# EAGLE design HSHV4-student version (EAGLE 7.2.0)
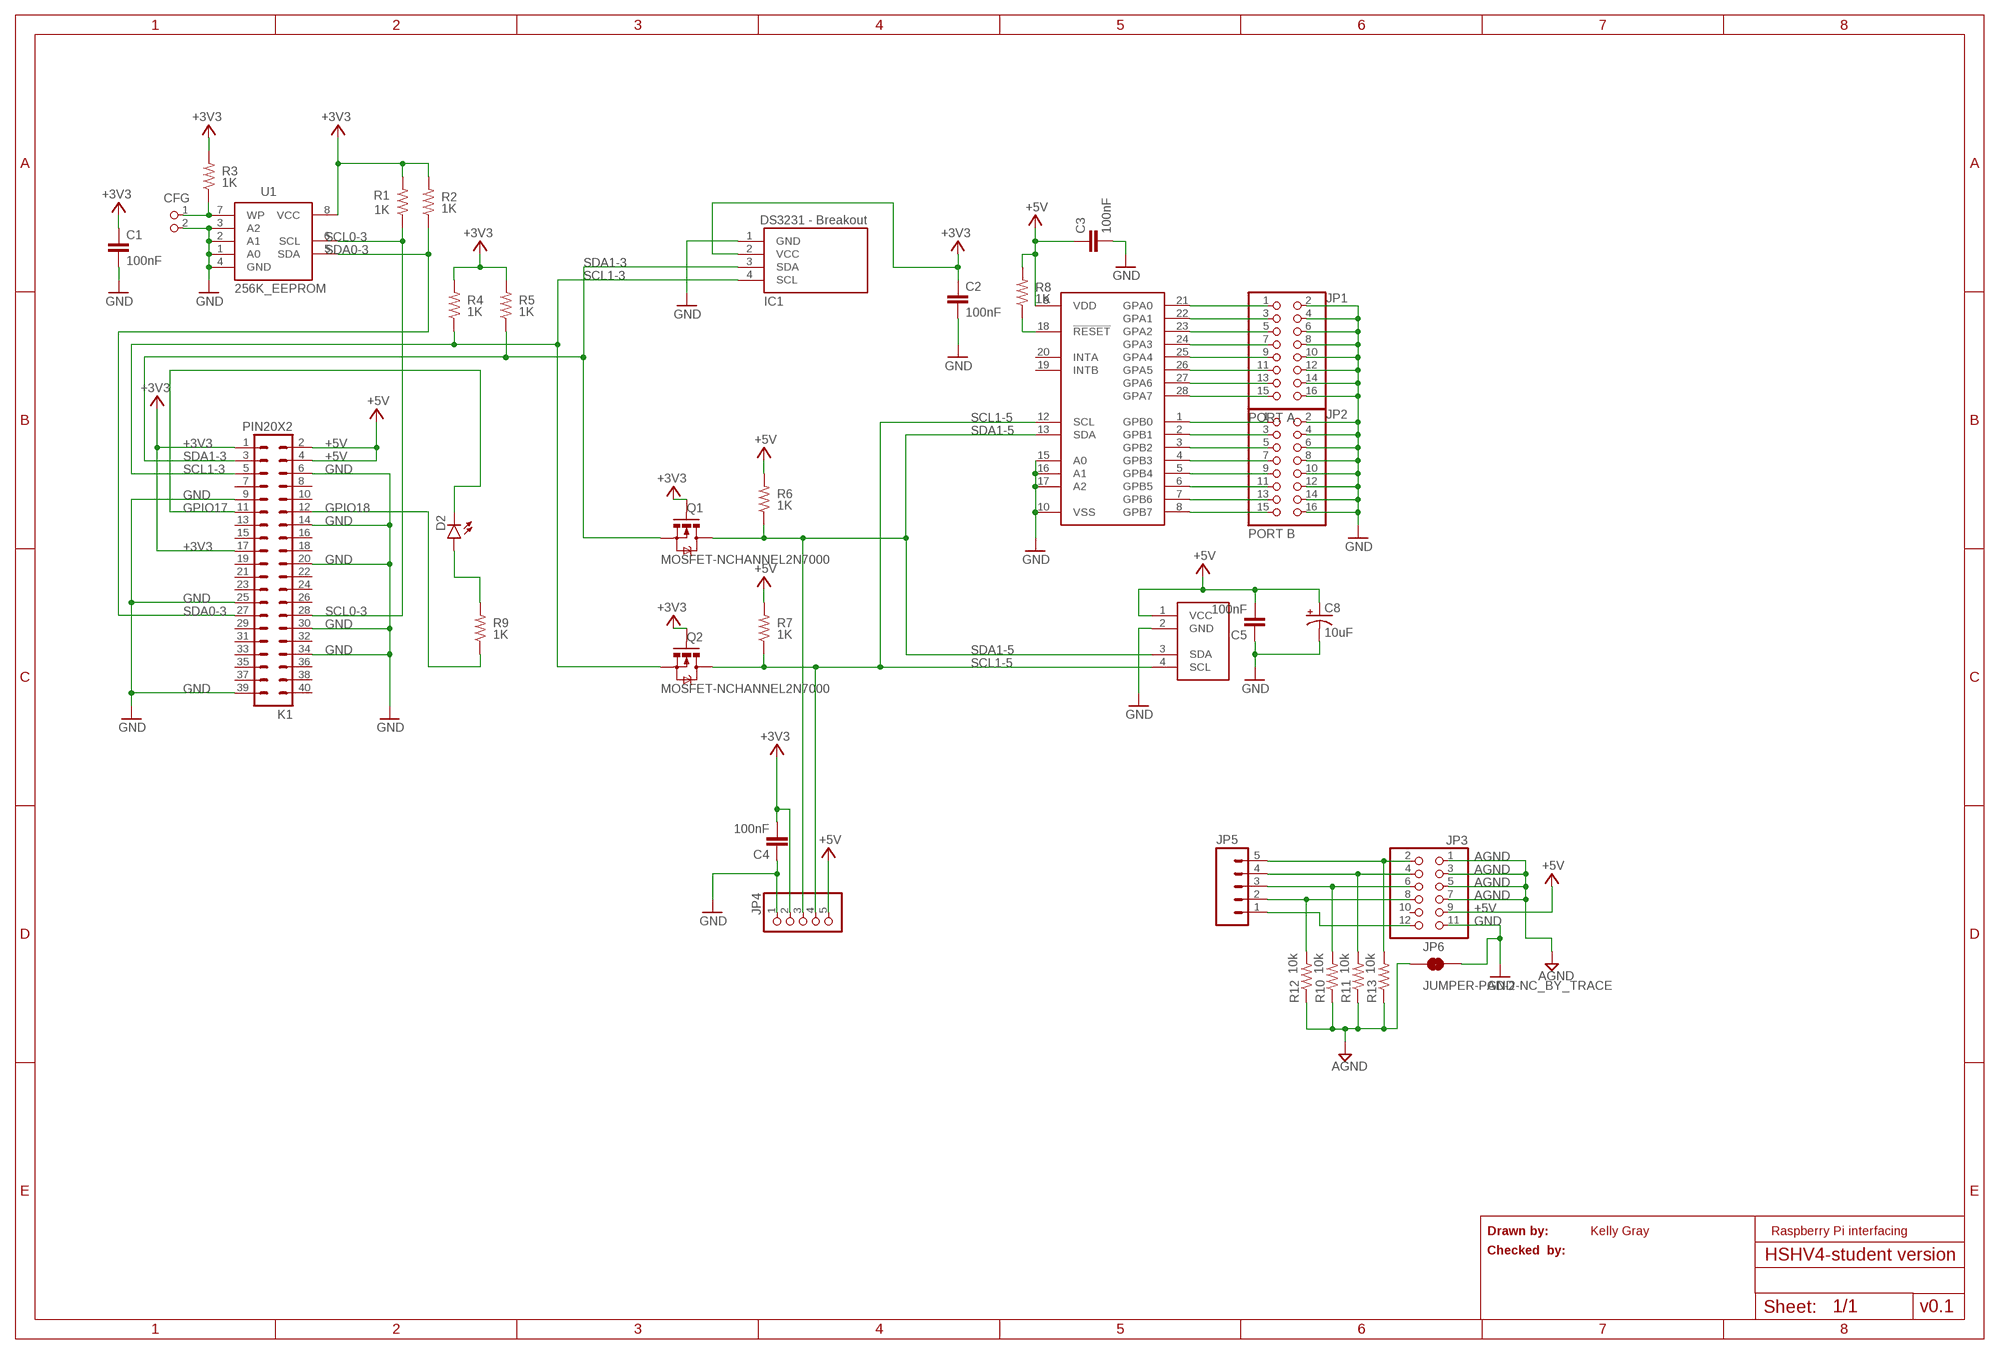
[diagram p0: schematic, sheet 1]

## Parts
C1  100nF  0.1UF-50V-20%(PTH)KIT-EZ  [CAP-PTH-SMALL-KIT]
C2  100nF  0.1UF-50V-20%(PTH)KIT-EZ  [CAP-PTH-SMALL-KIT]
C3  100nF  0.1UF-50V-20%(PTH)KIT-EZ  [CAP-PTH-SMALL-KIT]
C4  100nF  0.1UF-50V-20%(PTH)KIT-EZ  [CAP-PTH-SMALL-KIT]
C5  100nF  0.1UF-50V-20%(PTH)KIT-EZ  [CAP-PTH-SMALL-KIT]
C8  10uF  10UF-25V-20%(PTH)  [CPOL-RADIAL-10UF-25V]
CFG  PIN2_100  [PIN_W_2]
D2  LED-3MM-NO_SILK  [LED3MM-NS]
IC1  DS3231  [8PTH]
IC4  IO_EXPANDER  [DIL28-3]
JP1  PORT A  PINHD-2X8  [2X08]
JP2  PORT B  PINHD-2X8  [2X08]
JP3  PINHD-2X6  [2X06]
JP4  PINHD-1X5  [1X05]
JP5  M05PTH  [1X05]
JP6  JUMPER-PAD-2-NC_BY_TRACE  [PAD-JUMPER-2-NC_BY_TRACE_YES_SILK]
K1  PIN20X2  [PIN_20X2]
Q1  MOSFET-NCHANNEL2N7000  [TO-92]
Q2  MOSFET-NCHANNEL2N7000  [TO-92]
R1  1K  1KOHM-1/4W-1%(PTH)  [AXIAL-0.3]
R2  1K  1KOHM-1/4W-1%(PTH)  [AXIAL-0.3]
R3  1K  1KOHM-1/4W-1%(PTH)  [AXIAL-0.3]
R4  1K  1KOHM-1/4W-1%(PTH)  [AXIAL-0.3]
R5  1K  1KOHM-1/4W-1%(PTH)  [AXIAL-0.3]
R6  1K  1KOHM-1/4W-1%(PTH)  [AXIAL-0.3]
R7  1K  1KOHM-1/4W-1%(PTH)  [AXIAL-0.3]
R8  1K  1KOHM-1/4W-1%(PTH)  [AXIAL-0.3]
R9  1K  1KOHM-1/4W-1%(PTH)  [AXIAL-0.3]
R10  10k  10KOHM-1/4W-1%(PTH)HORIZ  [AXIAL-0.3]
R11  10k  10KOHM-1/4W-1%(PTH)HORIZ  [AXIAL-0.3]
R12  10k  10KOHM-1/4W-1%(PTH)HORIZ  [AXIAL-0.3]
R13  10k  10KOHM-1/4W-1%(PTH)HORIZ  [AXIAL-0.3]
U1  256K_EEPROM  [DIL08]
U$1  PCF8591  [1X04]

## Nets
+3V3: C1.1 C2.1 C4.2 IC1.2(VCC) JP4.2 K1.1 K1.17 Q1.2(G) Q2.2(G) R1.P$2 R2.P$2 R3.P$2 R4.P$2 R5.P$2 U1.8(VCC)
+5V: C3.1 C5.2 C8.1(+) IC4.9(VDD) JP3.9 JP4.5 K1.2 K1.4 R6.P$2 R7.P$2 R8.P$2 U$1.1(VCC)
AGND: JP3.1 JP3.3 JP3.5 JP3.7 JP6.1 R10.P$1 R11.P$1 R12.P$1 R13.P$1
AIN0: JP3.8 JP5.2 R12.P$2
AIN1: JP3.6 JP5.3 R10.P$2
AIN2: JP3.4 JP5.4 R11.P$2
AIN3: JP3.2 JP5.5 R13.P$2
GND: C1.2 C2.2 C3.2 C4.1 C5.1 C8.2(-) CFG.2 IC1.1(GND) IC4.10(VSS) IC4.15(A0) IC4.16(A1) IC4.17(A2) JP1.2 JP1.4 JP1.6 JP1.8 JP1.10 JP1.12 JP1.14 JP1.16 JP2.2 JP2.4 JP2.6 JP2.8 JP2.10 JP2.12 JP2.14 JP2.16 JP3.11 JP4.1 JP6.2 K1.6 K1.9 K1.14 K1.20 K1.25 K1.30 K1.34 K1.39 U1.1(A0) U1.2(A1) U1.3(A2) U1.4(GND) U$1.2(GND)
GPIO17: D2.K(C) K1.11
GPIO18: K1.12 R9.P$1
N$1: JP3.12 JP5.1
N$2: D2.A R9.P$2
N$3: CFG.1 R3.P$1 U1.7(WP)
N$12: IC4.21(GPA0) JP1.1
N$13: IC4.22(GPA1) JP1.3
N$15: IC4.18(!RESET) R8.P$1
N$16: IC4.23(GPA2) JP1.5
N$17: IC4.24(GPA3) JP1.7
N$18: IC4.25(GPA4) JP1.9
N$19: IC4.26(GPA5) JP1.11
N$20: IC4.27(GPA6) JP1.13
N$21: IC4.28(GPA7) JP1.15
N$22: IC4.1(GPB0) JP2.1
N$23: IC4.2(GPB1) JP2.3
N$24: IC4.3(GPB2) JP2.5
N$25: IC4.4(GPB3) JP2.7
N$26: IC4.5(GPB4) JP2.9
N$27: IC4.6(GPB5) JP2.11
N$28: IC4.7(GPB6) JP2.13
N$29: IC4.8(GPB7) JP2.15
SCL0-3: K1.28 R1.P$1 U1.6(SCL)
SCL1-3: IC1.4(SCL) K1.5 Q2.1(S) R4.P$1
SCL1-5: IC4.12(SCL) JP4.4 Q2.3(D) R7.P$1 U$1.4(SCL)
SDA0-3: K1.27 R2.P$1 U1.5(SDA)
SDA1-3: IC1.3(SDA) K1.3 Q1.1(S) R5.P$1
SDA1-5: IC4.13(SDA) JP4.3 Q1.3(D) R6.P$1 U$1.3(SDA)
Unconnected: IC4.19(INTB) IC4.20(INTA) JP3.10 K1.7 K1.8 K1.10 K1.13 K1.15 K1.16 K1.18 K1.19 K1.21 K1.22 K1.23 K1.24 K1.26 K1.29 K1.31 K1.32 K1.33 K1.35 K1.36 K1.37 K1.38 K1.40

## Notes on the sheet
- Drawn by: | Kelly Gray | Raspberry Pi interfacing
- Checked  by:
- v0.1

## Library data of the parts
C1-C5 = SparkFun-Capacitors:0.1UF-50V-20%(PTH): CAP-08370; DIELECTRIC: X7R; PROD_ID: CAP-08370
C8 = SparkFun-Capacitors:10UF-25V-20%(PTH): CAP-08440; DIELECTRIC: X7R; PROD_ID: CAP-08440
CFG = FLYFISH:PIN2
D2 = SparkFun-LED:LED: LEDs Standard schematic elements and footprints for 5mm, 3mm, 1206, and 0603 sized LEDs. 5mm - Spark Fun Electronics SKU : COM-00529 (and others)
IC1 = SenseHat:DS3231
IC4 = SenseHat:IO_EXPANDER
JP1 JP2 = pinhead:PINHD-2X8: PIN HEADER
JP3 = pinhead:PINHD-2X6: PIN HEADER
JP4 = pinhead:PINHD-1X5: PIN HEADER
JP5 = SparkFun-Connectors:M05: Header 5 Standard 5-pin 0.1" header. Use with straight break away headers (SKU : PRT-00116), right angle break away headers (PRT-00553), swiss pins (PRT-00743), machine pins (PRT-00117), and female headers (PRT-00115). Molex polarized connector foot print use with SKU : PRT-08230 with associated crimp pins and housings.
JP6 = SparkFun-Passives:JUMPER-PAD-2-NC_BY_TRACE
K1 = FLYFISH:PIN20X2
Q1 Q2 = SparkFun-DiscreteSemi:MOSFET-NCHANNEL: Common NMOSFET Parts MFG P/N Store ID Prod ID FDD8780 TRANS-09984 SI7820DN TRANS-11055 FDS6630A IC-08089 2N7002PW TRANS-11151 FQP30N06L COM-10213 TRANS-10060 BSS123LT1G TRANS-08345 BSS138 TRANS-00830 BS170 2N7000
R1-R9 = SparkFun-Resistors:1KOHM-1/4W-1%(PTH): RES-12182; PROD_ID: RES-12182; TOLERANCE: 5%
R10-R13 = SparkFun-Resistors:10KOHM-1/4W-1%(PTH): RES-12183; PROD_ID: RES-12183; TOLERANCE: 5%
U1 = SenseHat:256K_EEPROM
U$1 = SenseHat:PCF8591

## Board
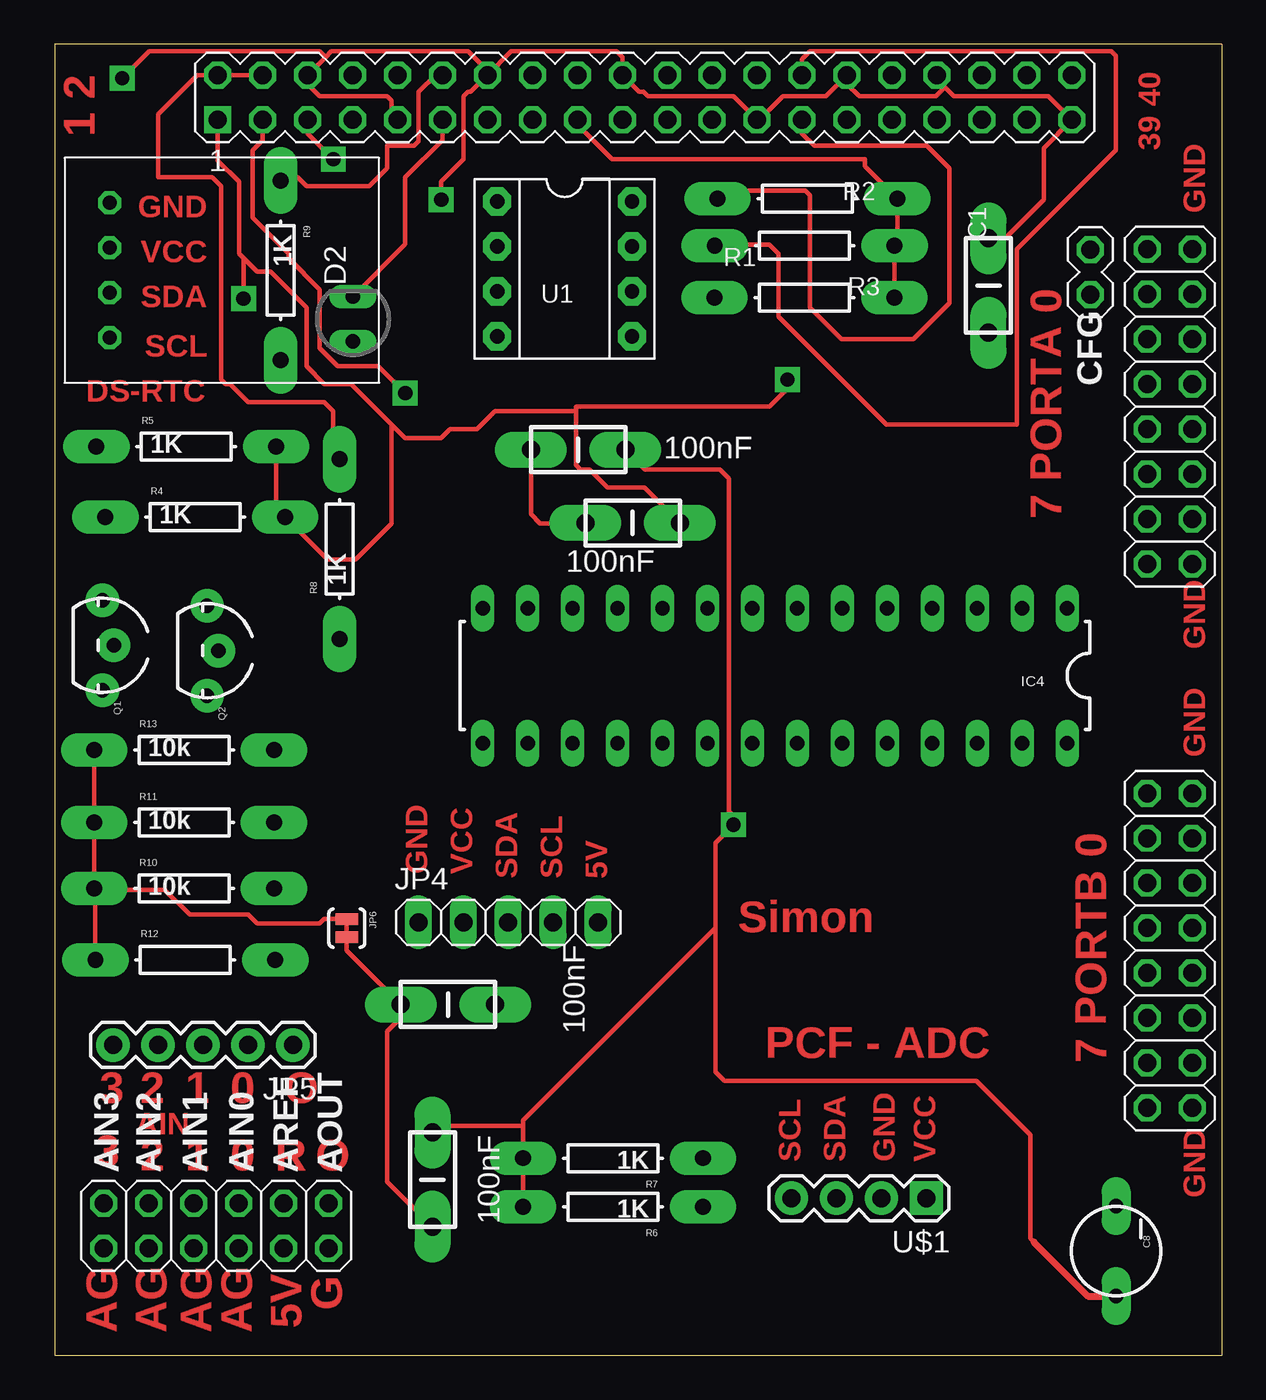
[diagram p1: board, top side]
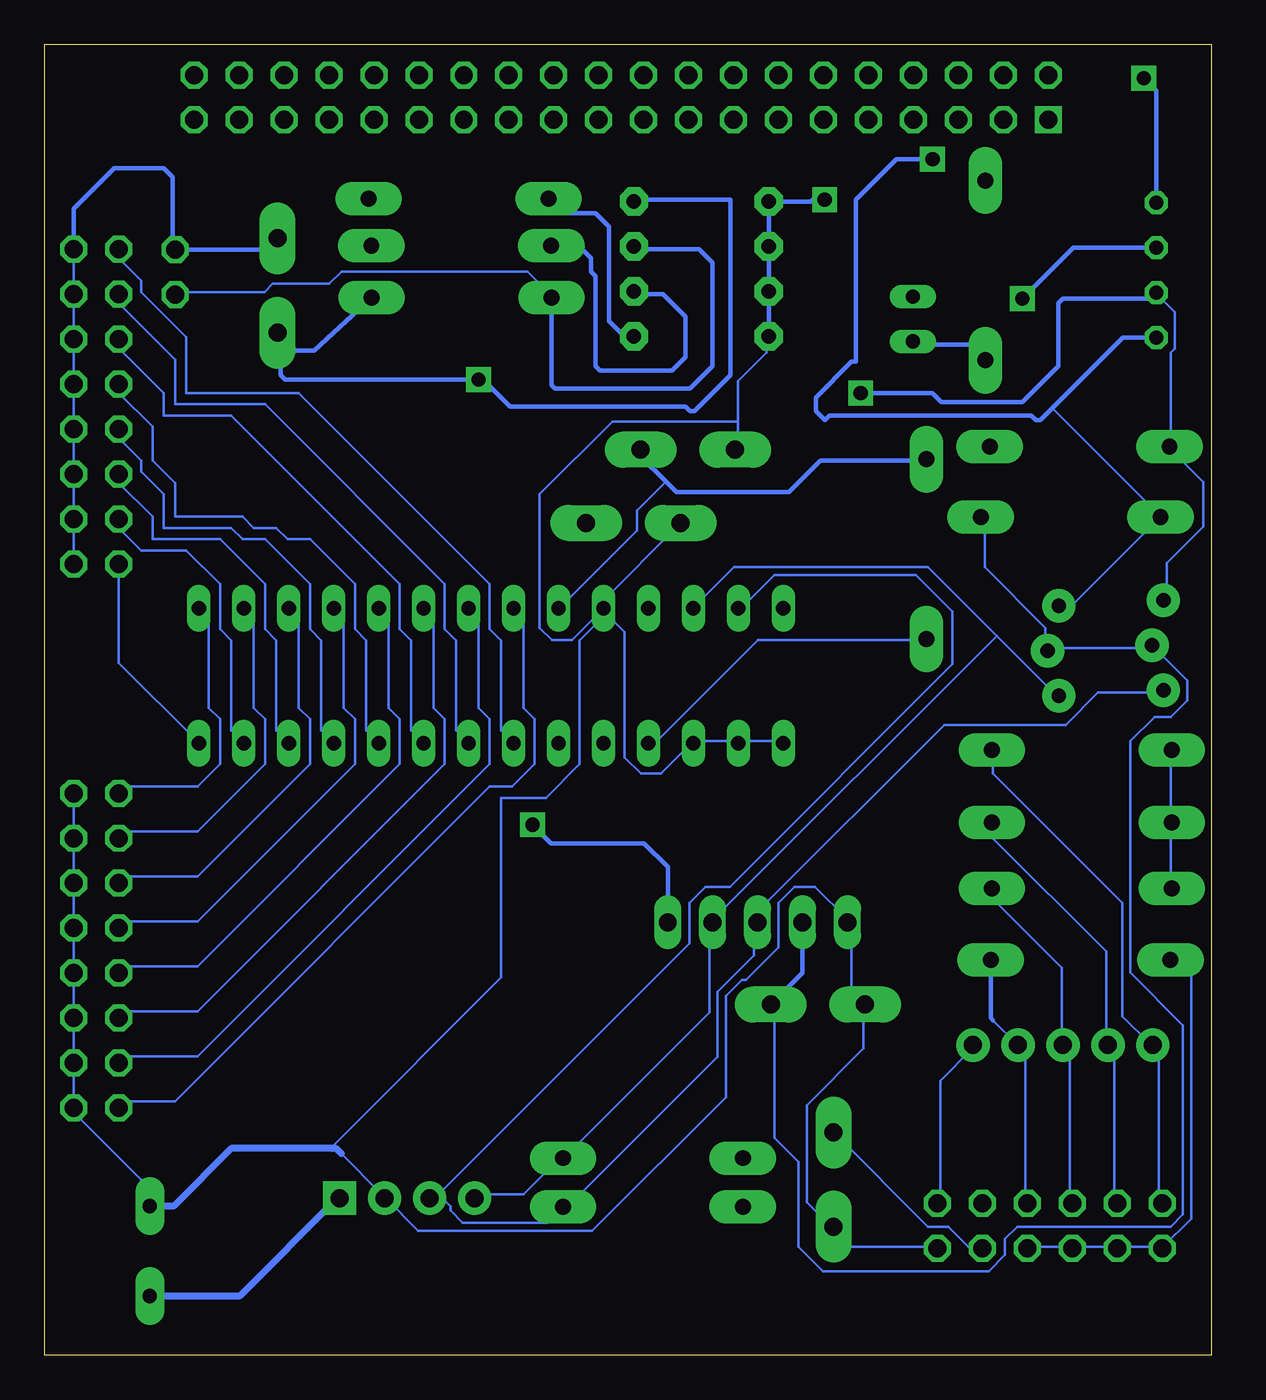
[diagram p2: board, bottom side, seen from below]

Size 65.94 x 74.06 mm. Coordinates in mm from the lower left corner, seen from the top.
Outline: 0,0 65.94,0 65.94,74.06 0,74.06 0,0
Copper layers (1*16): Top 0.035mm / dielectric 1.5mm / Bottom 0.035mm
Design rules "ITEADstudio_DRC *": minimum track width 6mil, minimum drill 0.8mm, track to track 12mil, track to pad 12mil, pad to pad 12mil, via to via 12mil, smd to smd 0mil, copper to edge 10mil, drill to drill 10mil, minimum pad ring 10mil, minimum via ring 12mil, stop-mask expansion 2mil, vias tented up to drill 100mil, thermal gap 10mil

### Footprints (pad centres in the part's own frame; a part is rotated, then mirrored left to right if it is on the bottom)
CAP-PTH-SMALL-KIT = drill 1.016 pad 2.032 long: 1 -2.667,0; 2 2.667,0
CPOL-RADIAL-10UF-25V = drill 0.8 pad 1.651 long: 1 2.54,0; 2 -2.54,0
PIN_W_2 = drill 1.016 octagon: 1 0,0; 2 0,-2.54
LED3MM-NS = drill 0.813 long: A -1.27,0; K 1.27,0
8PTH = drill 0.8 pad 1.27 octagon: 1 -3.81,0; 2 -1.27,0; 3 1.27,0; 4 3.81,0
DIL28-3 = drill 0.813 long: 1 -16.51,-3.81; 2 -13.97,-3.81; 3 -11.43,-3.81; 4 -8.89,-3.81; 5 -6.35,-3.81; 6 -3.81,-3.81; 7 -1.27,-3.81; 8 1.27,-3.81; 9 3.81,-3.81; 10 6.35,-3.81; 11 8.89,-3.81; 12 11.43,-3.81; 13 13.97,-3.81; 14 16.51,-3.81; 15 16.51,3.81; 16 13.97,3.81; 17 11.43,3.81; 18 8.89,3.81; 19 6.35,3.81; 20 3.81,3.81; 21 1.27,3.81; 22 -1.27,3.81; 23 -3.81,3.81; 24 -6.35,3.81; 25 -8.89,3.81; 26 -11.43,3.81; 27 -13.97,3.81; 28 -16.51,3.81
2X08 = drill 1.016 octagon: 1 -8.89,-1.27; 2 -8.89,1.27; 3 -6.35,-1.27; 4 -6.35,1.27; 5 -3.81,-1.27; 6 -3.81,1.27; 7 -1.27,-1.27; 8 -1.27,1.27; 9 1.27,-1.27; 10 1.27,1.27; 11 3.81,-1.27; 12 3.81,1.27; 13 6.35,-1.27; 14 6.35,1.27; 15 8.89,-1.27; 16 8.89,1.27
2X06 = drill 1.016 octagon: 1 -6.35,-1.27; 2 -6.35,1.27; 3 -3.81,-1.27; 4 -3.81,1.27; 5 -1.27,-1.27; 6 -1.27,1.27; 7 1.27,-1.27; 8 1.27,1.27; 9 3.81,-1.27; 10 3.81,1.27; 11 6.35,-1.27; 12 6.35,1.27
1X05 = drill 1.016 long: 1 -5.08,0; 2 -2.54,0; 3 0,0; 4 2.54,0; 5 5.08,0
1X05' = drill 1.016 pad 1.88: 1 0,0; 2 2.54,0; 3 5.08,0; 4 7.62,0; 5 10.16,0
PAD-JUMPER-2-NC_BY_TRACE_YES_SILK = smd 0.635 x 1.27: 1 -0.508,0; 2 0.508,0
PIN_20X2 = drill 1.016 square: 1 -24.13,-1.27 | drill 1.016 octagon: 2 -24.13,1.27; 3 -21.59,-1.27; 4 -21.59,1.27; 5 -19.05,-1.27; 6 -19.05,1.27; 7 -16.51,-1.27; 8 -16.51,1.27; 9 -13.97,-1.27; 10 -13.97,1.27; 11 -11.43,-1.27; 12 -11.43,1.27; 13 -8.89,-1.27; 14 -8.89,1.27; 15 -6.35,-1.27; 16 -6.35,1.27; 17 -3.81,-1.27; 18 -3.81,1.27; 19 -1.27,-1.27; 20 -1.27,1.27; 21 1.27,-1.27; 22 1.27,1.27; 23 3.81,-1.27; 24 3.81,1.27; 25 6.35,-1.27; 26 6.35,1.27; 27 8.89,-1.27; 28 8.89,1.27; 29 11.43,-1.27; 30 11.43,1.27; 31 13.97,-1.27; 32 13.97,1.27; 33 16.51,-1.27; 34 16.51,1.27; 35 19.05,-1.27; 36 19.05,1.27; 37 21.59,-1.27; 38 21.59,1.27; 39 24.13,-1.27; 40 24.13,1.27
TO-92 = drill 0.813 pad 1.88: 1 -2.54,0; 2 0,0.635; 3 2.54,0
AXIAL-0.3 = drill 0.9 pad 1.88 long: P$1 -5.08,0; P$2 5.08,0
DIL08 = drill 0.813 pad 1.6 octagon: 1 -3.81,-3.81; 2 -1.27,-3.81; 3 1.27,-3.81; 4 3.81,-3.81; 5 3.81,3.81; 6 1.27,3.81; 7 -1.27,3.81; 8 -3.81,3.81
1X04 = drill 1.016 pad 1.88 square: 1 0,0 | drill 1.016 pad 1.88: 2 2.54,0; 3 5.08,0; 4 7.62,0

### Placement (x,y rotation side)
C1  52.76,60.44 90 top
C2  32.66,47.03 180 top
C3  21.35,9.92 270 top
C4  22.23,19.81 0 top
C5  29.57,51.16 0 top
C8  59.97,5.88 270 top
CFG  58.53,59.93 180 top
D2  16.86,58.54 90 top
IC1  3.1,61.3 270 top
IC4  40.69,38.39 180 top
JP1  62.99,53.59 270 top
JP2  62.99,22.86 270 top
JP3  9.12,7.31 0 top
JP4  25.63,24.46 0 top
JP5  [1X05']  13.46,17.53 180 top
JP6  16.51,24.13 270 top
K1  33.34,71.06 0 top
Q1  2.71,40.11 270 top
Q2  8.61,39.8 270 top
R1  42.38,62.68 0 top
R2  42.53,65.33 0 top
R3  42.36,59.75 0 top
R4  7.95,47.35 0 top
R5  7.44,51.34 0 top
R6  31.55,8.39 180 top
R7  31.55,11.14 180 top
R8  16.1,45.54 90 top
R9  12.77,61.29 270 top
R10  7.31,26.36 0 top
R11  7.31,30.09 0 top
R12  7.39,22.34 0 top
R13  7.31,34.2 0 top
U1  28.81,61.37 270 top
U$1  49.25,8.88 180 top

### Tracks (layer width: path | path; a pad name or v marks a point on that pad's centre or on a via)
+3V3  (via drill 0.8)
  Top 0.254: K1.1 9.21,67.5 10.41,66.29 10.41,62.23 10.67,61.98 | 10.67,61.98 11.43,61.21 12.19,61.21 14.22,59.18 14.22,55.88 15.24,54.86 16.76,54.86 19.05,52.58 | 19.05,52.58 19.05,46.99 17.02,44.96 15.42,44.96 R4.P$2 12.52,47.86 R5.P$2 | K1.17 29.53,69.53 31.5,67.56 45.78,67.56 45.78,67.16 R2.P$2 47.61,62.83 R1.P$2 47.45,60.02 R3.P$2 | C2.1 33.33,49.02 31.24,49.02 30.23,50.04 29.72,50.04 29.46,50.29 29.46,53.34 | 29.46,53.34 29.46,53.59 40.39,53.59 41.4,54.61 v41.4,55.12 | 10.67,61.98 v10.67,59.69 | 19.05,52.58 19.81,51.82 21.84,51.82 22.35,52.32 23.88,52.32 24.89,53.34 29.46,53.34
  Bottom 0.152: C4.2 24.69,19.61 24.69,12.29 23.32,10.92 23.32,6.12 21.95,4.75 12.57,4.75 11.66,5.66 11.66,6.58 10.97,7.26 2.29,7.26 1.6,7.95 1.6,18.64 4.57,21.61 4.57,34.7 3.2,36.07 2.29,36.07 1.37,36.98 1.37,38.12 3.2,39.95 Q1.2 3.43,39.95 9.14,39.95 Q2.2 9.37,39.95 9.37,41.1 12.8,44.53 12.8,47.27 R4.P$2
  Bottom 0.254: v10.67,59.69 7.79,62.57 IC1.2 | U1.8 32.53,65.28 27.18,65.28 27.18,55.37 29.21,53.34 29.46,53.34 29.72,53.59 39.62,53.59 41.15,55.12 v41.4,55.12 52.32,55.12 52.58,55.37 52.58,57.59 C1.1 51.75,56.76 50.69,56.76 R3.P$2 | C4.2 23.09,21.61 JP4.2
+5V  (via drill 0.8)
  Top 0.254: K1.2 K1.4 8.07,72.33 5.84,70.1 5.84,66.55 8.89,66.55 9.4,66.04 9.4,55.12 9.65,54.86 9.91,54.86 10.92,53.85 15.24,53.85 15.75,53.34 15.75,50.98 R8.P$2 | C5.2 33.36,50.04 37.59,50.04 38.1,49.53 38.1,30.73 38.35,30.48 v38.35,29.97 37.34,28.96 37.34,24.13 | 37.34,24.13 26.47,13.26 26.47,12.95 | 26.47,12.95 R7.P$2 R6.P$2 | C3.1 21.71,12.95 26.47,12.95 | 55.33,6.39 55.12,6.6 55.12,12.45 52.07,15.49 37.85,15.49 37.34,16 37.34,24.13
  Top 0.406: 55.33,6.39 58.38,3.34 C8.1
  Bottom 0.152: 30.82,49.37 32.46,47.73 32.46,46.58 36.8,42.24 IC4.9 | JP3.9 13.03,6.12 13.72,6.12 14.86,7.26 16,7.26 21.26,12.52 C3.1 | 49.38,8.87 U$1.1
  Bottom 0.254: JP4.5 30.71,27.57 32.05,28.91 37.29,28.91 v38.35,29.97 | R8.P$2 16.18,50.55 22.1,50.55 23.88,48.77 30.23,48.77 30.82,49.37 32.24,50.78 C5.2
  Bottom 0.406: 49.38,8.87 54.9,3.34 C8.1
AGND
  Top 0.254: R13.P$1 R11.P$1 R10.P$1 2.31,26.29 | 2.31,26.29 R12.P$1 | 2.31,26.29 6.22,26.29 7.62,24.89 10.92,24.89 11.43,24.38 14.99,24.38 15.24,24.64 JP6.1
  Bottom 0.152: JP3.7 10.29,6.12 8,6.12 JP3.5 7.77,6.12 5.49,6.12 JP3.3 5.26,6.12 2.97,6.12 JP3.1 2.74,6.12 1.14,7.72 1.14,21.67 | R10.P$1 2.29,26.47 2.29,29.9 R11.P$1 2.29,30.12 2.29,34.01 R13.P$1
  Bottom 0.254: 1.14,21.67 1.63,21.67 R12.P$1
AIN0
  Bottom 0.152: JP3.8 10.52,8.64 10.52,17.09 10.74,17.32 JP5.2 10.97,17.55 12.34,18.92
  Bottom 0.254: R12.P$2 12.47,19.05 12.34,18.92
AIN1
  Bottom 0.152: JP3.6 8,8.64 8,17.09 8.23,17.32 JP5.3 8.46,17.55 8.46,21.89 12.34,25.78 12.34,26.24 R10.P$2
AIN2
  Bottom 0.152: JP3.4 5.49,8.64 5.49,17.09 5.71,17.32 JP5.4 5.94,17.55 5.94,22.81 12.34,29.21 12.34,29.9 R11.P$2
AIN3
  Bottom 0.152: JP3.2 2.97,8.64 2.97,17.09 3.2,17.32 JP5.5 3.43,17.55 5.03,19.15 5.03,25.55 12.34,32.87 12.34,34.01 R13.P$2
GND  (via drill 0.8)
  Top 0.254: K1.9 19.05,70.11 19.05,70.87 18.8,71.12 14.99,71.12 14.29,71.81 K1.6 15.3,73.34 | K1.14 24.45,72.58 23.37,73.66 15.62,73.66 15.3,73.34 | K1.14 25.78,73.66 31.75,73.66 32.07,73.34 K1.20 33.02,71.37 33.27,71.37 33.53,71.12 38.36,71.12 K1.25 39.82,69.79 41.15,71.12 43.56,71.12 K1.30 44.77,71.81 45.47,71.12 49.78,71.12 50.29,71.63 | 50.29,71.63 49.85,72.07 K1.34 | 50.29,71.63 50.8,71.12 56.14,71.12 K1.39 55.88,68.2 55.88,65.28 53.71,63.11 C1.2 | v3.81,72.14 5.33,73.66 14.99,73.66 15.3,73.34 | K1.14 23.5,71.37 23.37,71.37 23.11,71.12 23.11,67.56 21.84,66.29 v21.84,65.28 | C2.2 29.95,46.99 27.43,46.99 26.91,47.52 C5.1 | C3.2 18.8,9.81 18.8,18.29 19.56,19.05 C4.1 16.51,22.86 JP6.2
  Bottom 0.152: IC4.15 24.23,34.7 26.52,34.7 IC4.16 26.75,34.7 29.26,34.7 IC4.17 29.49,34.47 31.09,32.87 32.23,32.87 33.15,33.78 33.15,40.87 34.29,42.01 IC4.10 | IC4.10 34.29,42.24 34.29,42.7 30.18,46.81 C2.2 | 26.75,52.76 26.75,55.04 25.15,56.64 25.15,57.56 U1.4 | 26.75,52.76 26.75,51.38 C5.1 | 26.75,52.76 33.83,52.76 37.95,48.64 37.95,41.1 37.26,40.41 36.12,40.41 34.52,42.01 IC4.10 | JP3.11 15.55,6.12 20.35,6.12 21.26,7.04 C3.2 21.49,7.26 22.86,8.64 22.86,14.12 19.66,17.32 19.66,19.61 C4.1 19.66,19.84 20.35,20.52 20.35,24.41 JP4.1 20.57,24.64 22.4,26.47 23.55,26.47 24.46,25.55 24.46,23.04 26.29,21.21 26.52,21.21 27.43,20.29 27.43,14.58 34.98,7.04 44.81,7.04 46.63,8.87 U$1.2 46.86,9.09 49.15,11.38 | JP2.2 JP2.4 JP2.6 JP2.8 JP2.10 JP2.12 JP2.14 JP2.16 64.26,13.72 60.45,9.91 60.45,8.64 C8.2 | JP1.16 JP1.14 JP1.12 JP1.10 JP1.8 JP1.6 JP1.4 JP1.2 | IC4.10 34.42,41.66 35.69,40.39 35.69,33.4 37.59,31.5 40.13,31.5 40.13,21.34 49.66,11.81 49.66,11.68
  Bottom 0.254: IC1.1 3.1,71.43 v3.81,72.14 | v21.84,65.28 22.19,65.63 22.63,65.18 U1.1 U1.2 U1.3 U1.4 | JP1.2 64.26,64.77 61.98,67.06 59.18,67.06 58.67,66.55 58.67,62.61 CFG.2 53.4,62.47 C1.2
  Bottom 0.406: 49.15,11.38 49.45,11.68 49.66,11.68 55.37,11.68 58.63,8.42 C8.2
GPIO17
  Top 0.254: K1.11 21.91,68.65 19.81,66.55 19.81,62.76 D2.K
GPIO18
  Top 0.254: K1.12 21.53,72.33 20.57,71.37 20.57,68.58 20.32,68.33 18.8,68.33 18.8,67.06 17.78,66.04 14.22,66.04 13.72,66.55 12.96,66.55 R9.P$1
N$1
  Bottom 0.152: JP3.12 15.32,8.64 15.32,15.49 13.49,17.32 JP5.1
N$2
  Bottom 0.152: 13.49,57.1 12.8,56.41 R9.P$2
  Bottom 0.254: 13.49,57.1 16.69,57.1 D2.A
N$3
  Bottom 0.152: 37.49,60.07 38.63,61.21 49.15,61.21 49.84,60.53 53.03,60.53 53.49,60.07 58.52,60.07 CFG.1
  Bottom 0.254: U1.7 32.46,62.48 28.96,62.48 28.19,61.72 28.19,55.88 29.46,54.61 37.08,54.61 37.28,54.81 R3.P$1 37.35,60.07 37.49,60.07
N$12
  Bottom 0.152: IC4.21 39.5,34.67 40.13,35.31 40.13,40.39 40.77,41.02 40.77,43.56 51.56,54.36 57.91,54.36 57.91,57.53 60.45,60.07 60.45,60.71 61.72,61.98 JP1.1
N$13
  Bottom 0.152: IC4.22 42.04,34.67 42.67,35.31 42.67,40.39 43.31,41.02 43.31,43.56 53.47,53.72 58.55,53.72 58.55,56.26 61.72,59.44 JP1.3
N$15
  Bottom 0.152: IC4.18 31.78,34.7 31.32,34.7 25.6,40.41 16.23,40.41 R8.P$1
N$16
  Bottom 0.152: IC4.23 44.58,34.67 45.21,35.31 45.21,40.39 45.85,41.02 45.85,43.56 55.37,53.09 59.18,53.09 59.18,54.36 61.72,56.9 JP1.5
N$17
  Bottom 0.152: IC4.24 47.12,34.67 47.75,35.31 47.75,40.39 48.39,41.02 48.39,43.56 50.93,46.1 52.2,46.1 52.83,46.74 54.1,46.74 54.74,47.37 58.55,47.37 58.55,49.28 59.82,50.55 59.82,52.45 61.72,54.36 JP1.7
N$18
  Bottom 0.152: IC4.25 49.66,34.67 50.29,35.31 50.29,40.39 50.93,41.02 50.93,43.56 53.47,46.1 54.74,46.1 55.37,46.74 59.18,46.74 59.18,48.64 60.45,49.91 60.45,50.55 61.72,51.82 JP1.9
N$19
  Bottom 0.152: IC4.26 52.2,34.67 52.83,35.31 52.83,40.39 53.47,41.02 53.47,43.56 56.01,46.1 59.82,46.1 59.82,47.37 61.72,49.28 JP1.11
N$20
  Bottom 0.152: IC4.27 54.74,34.67 55.37,35.31 55.37,40.39 56.01,41.02 56.01,43.56 57.91,45.47 60.45,45.47 61.72,46.74 JP1.13
N$21
  Bottom 0.152: JP1.15 61.72,39.12 57.28,34.67 IC4.28
N$22
  Bottom 0.152: IC4.1 56.64,41.66 56.64,36.58 56.01,35.94 56.01,33.4 57.28,32.13 61.72,32.13 JP2.1
N$23
  Bottom 0.152: IC4.2 54.1,41.66 54.1,36.58 53.47,35.94 53.47,33.4 57.28,29.59 61.72,29.59 JP2.3
N$24
  Bottom 0.152: IC4.3 51.56,41.66 51.56,36.58 50.93,35.94 50.93,33.4 57.28,27.05 61.72,27.05 JP2.5
N$25
  Bottom 0.152: IC4.4 49.02,41.66 49.02,36.58 48.39,35.94 48.39,33.4 57.28,24.51 61.72,24.51 JP2.7
N$26
  Bottom 0.152: IC4.5 46.48,41.66 46.48,36.58 45.85,35.94 45.85,33.4 57.28,21.97 61.72,21.97 JP2.9
N$27
  Bottom 0.152: IC4.6 43.94,41.66 43.94,36.58 43.31,35.94 43.31,33.4 57.28,19.43 61.72,19.43 JP2.11
N$28
  Bottom 0.152: IC4.7 41.4,41.66 41.4,36.58 40.77,35.94 40.77,33.4 57.28,16.89 61.72,16.89 JP2.13
N$29
  Bottom 0.152: IC4.8 38.86,41.66 38.86,36.58 38.23,35.94 38.23,33.4 39.5,32.13 40.77,32.13 58.55,14.35 61.72,14.35 JP2.15
SCL0-3
  Top 0.254: K1.28 42.23,73.22 42.67,73.66 59.69,73.66 59.94,73.41 59.94,68.07 54.36,62.48 54.36,52.58 46.99,52.58 40.89,58.67 40.89,62.23 40.39,62.74 37.35,62.74 R1.P$1
  Bottom 0.254: U1.6 32.46,59.94 30.99,59.94 29.72,58.67 29.72,56.39 30.48,55.63 34.54,55.63 34.8,55.88 34.8,60.96 35.05,61.21 35.05,61.98 35.87,62.8 37.18,62.8 R1.P$1
SCL1-3  (via drill 0.8)
  Top 0.254: K1.5 14.29,69.02 v15.75,67.56
  Bottom 0.152: Q2.1 8.46,42.47 7.77,42.47 2.97,47.27 R4.P$1 2.97,47.5 8.98,53.51
  Bottom 0.254: v15.75,67.56 17.78,67.56 20.07,65.28 20.07,56.13 20.32,56.13 22.35,54.1 22.35,53.34 21.84,52.83 21.59,53.09 10.16,53.09 9.91,52.83 9.65,52.83 8.98,53.51 5,57.49 IC1.4
SCL1-5
  Bottom 0.152: 12.12,40.64 8.69,37.21 Q2.3 | 12.12,40.64 16,44.53 26.98,44.53 29.26,42.24 IC4.12 | U$1.4 41.6,9.09 38.86,9.09 36.8,11.15 R7.P$1 36.58,11.15 28.35,19.38 28.35,24.41 JP4.4 28.12,24.64 12.12,40.64
SDA0-3
  Top 0.254: K1.27 42.23,69.02 42.93,68.33 49.28,68.33 50.55,67.06 50.55,59.44 48.51,57.4 44.45,57.4 42.67,59.18 42.67,65.53 42.42,65.79 37.9,65.79 R2.P$1
  Bottom 0.254: U1.5 33.18,57.56 34.04,58.42 34.04,63.75 34.8,64.52 36.63,64.52 R2.P$1
SDA1-3  (via drill 0.8)
  Top 0.254: K1.3 11.75,68.65 11.18,68.07 11.18,64.26 13.21,62.23 13.21,61.98 14.99,60.2 14.99,56.9 16,55.88 18.29,55.88 v19.81,54.36
  Bottom 0.152: Q1.1 2.52,42.7 2.52,44.76 0.46,46.81 0.46,49.33 2.29,51.16 R5.P$1 2.29,51.38 2.29,56.64 2.06,56.87 2.06,58.93 2.97,59.84 IC1.3
  Bottom 0.254: v19.81,54.36 15.75,54.36 15.24,53.85 10.67,53.85 8.64,55.88 8.64,59.44 8.38,59.69 3.44,59.69 IC1.3
SDA1-5
  Bottom 0.152: 43.66,9.09 29.49,23.27 29.49,25.55 28.57,26.47 27.2,26.47 14.63,39.04 14.63,42.01 16.69,44.07 24.69,44.07 26.52,42.24 IC4.13 | 43.66,9.09 44.12,9.09 U$1.3 43.66,9.09 | Q1.3 2.74,37.44 6.4,37.44 8.23,35.61 15.09,35.61 25.6,25.09 25.6,24.64 JP4.3 25.83,24.41 25.83,22.58 27.89,20.52 27.89,16.87 36.58,8.18 R6.P$1 36.8,8.18 37.49,7.49 42.29,7.49 42.98,8.18 42.98,8.41 43.66,9.09

### Text on the board
Top: 1 2 | 39 40 | GND | GND | VCC | SDA | SCL | DS-RTC | 7 PORTA 0 | GND | GND | GND | VCC | SDA | SCL | 5V | Simon | PCF - ADC | 7 PORTB 0 | 3 | 2 | 1 | 0 | O | AIN | 3 | 2 | 1 | 0 | R | O | SCL | SDA | GND | VCC | GND | G | AG | AG | AG | AG | 5V
tPlace: AIN3 | AIN2 | AIN1 | AIN0 | AREF | AOUT